# Altium schematic sheet MKV58(1.SchDoc
size A3; Organization: Altium Limited; Address1: L3, 12a Rodborough Rd; Address2: Frenchs Forest; Address3: NSW; Address4: Australia 2086
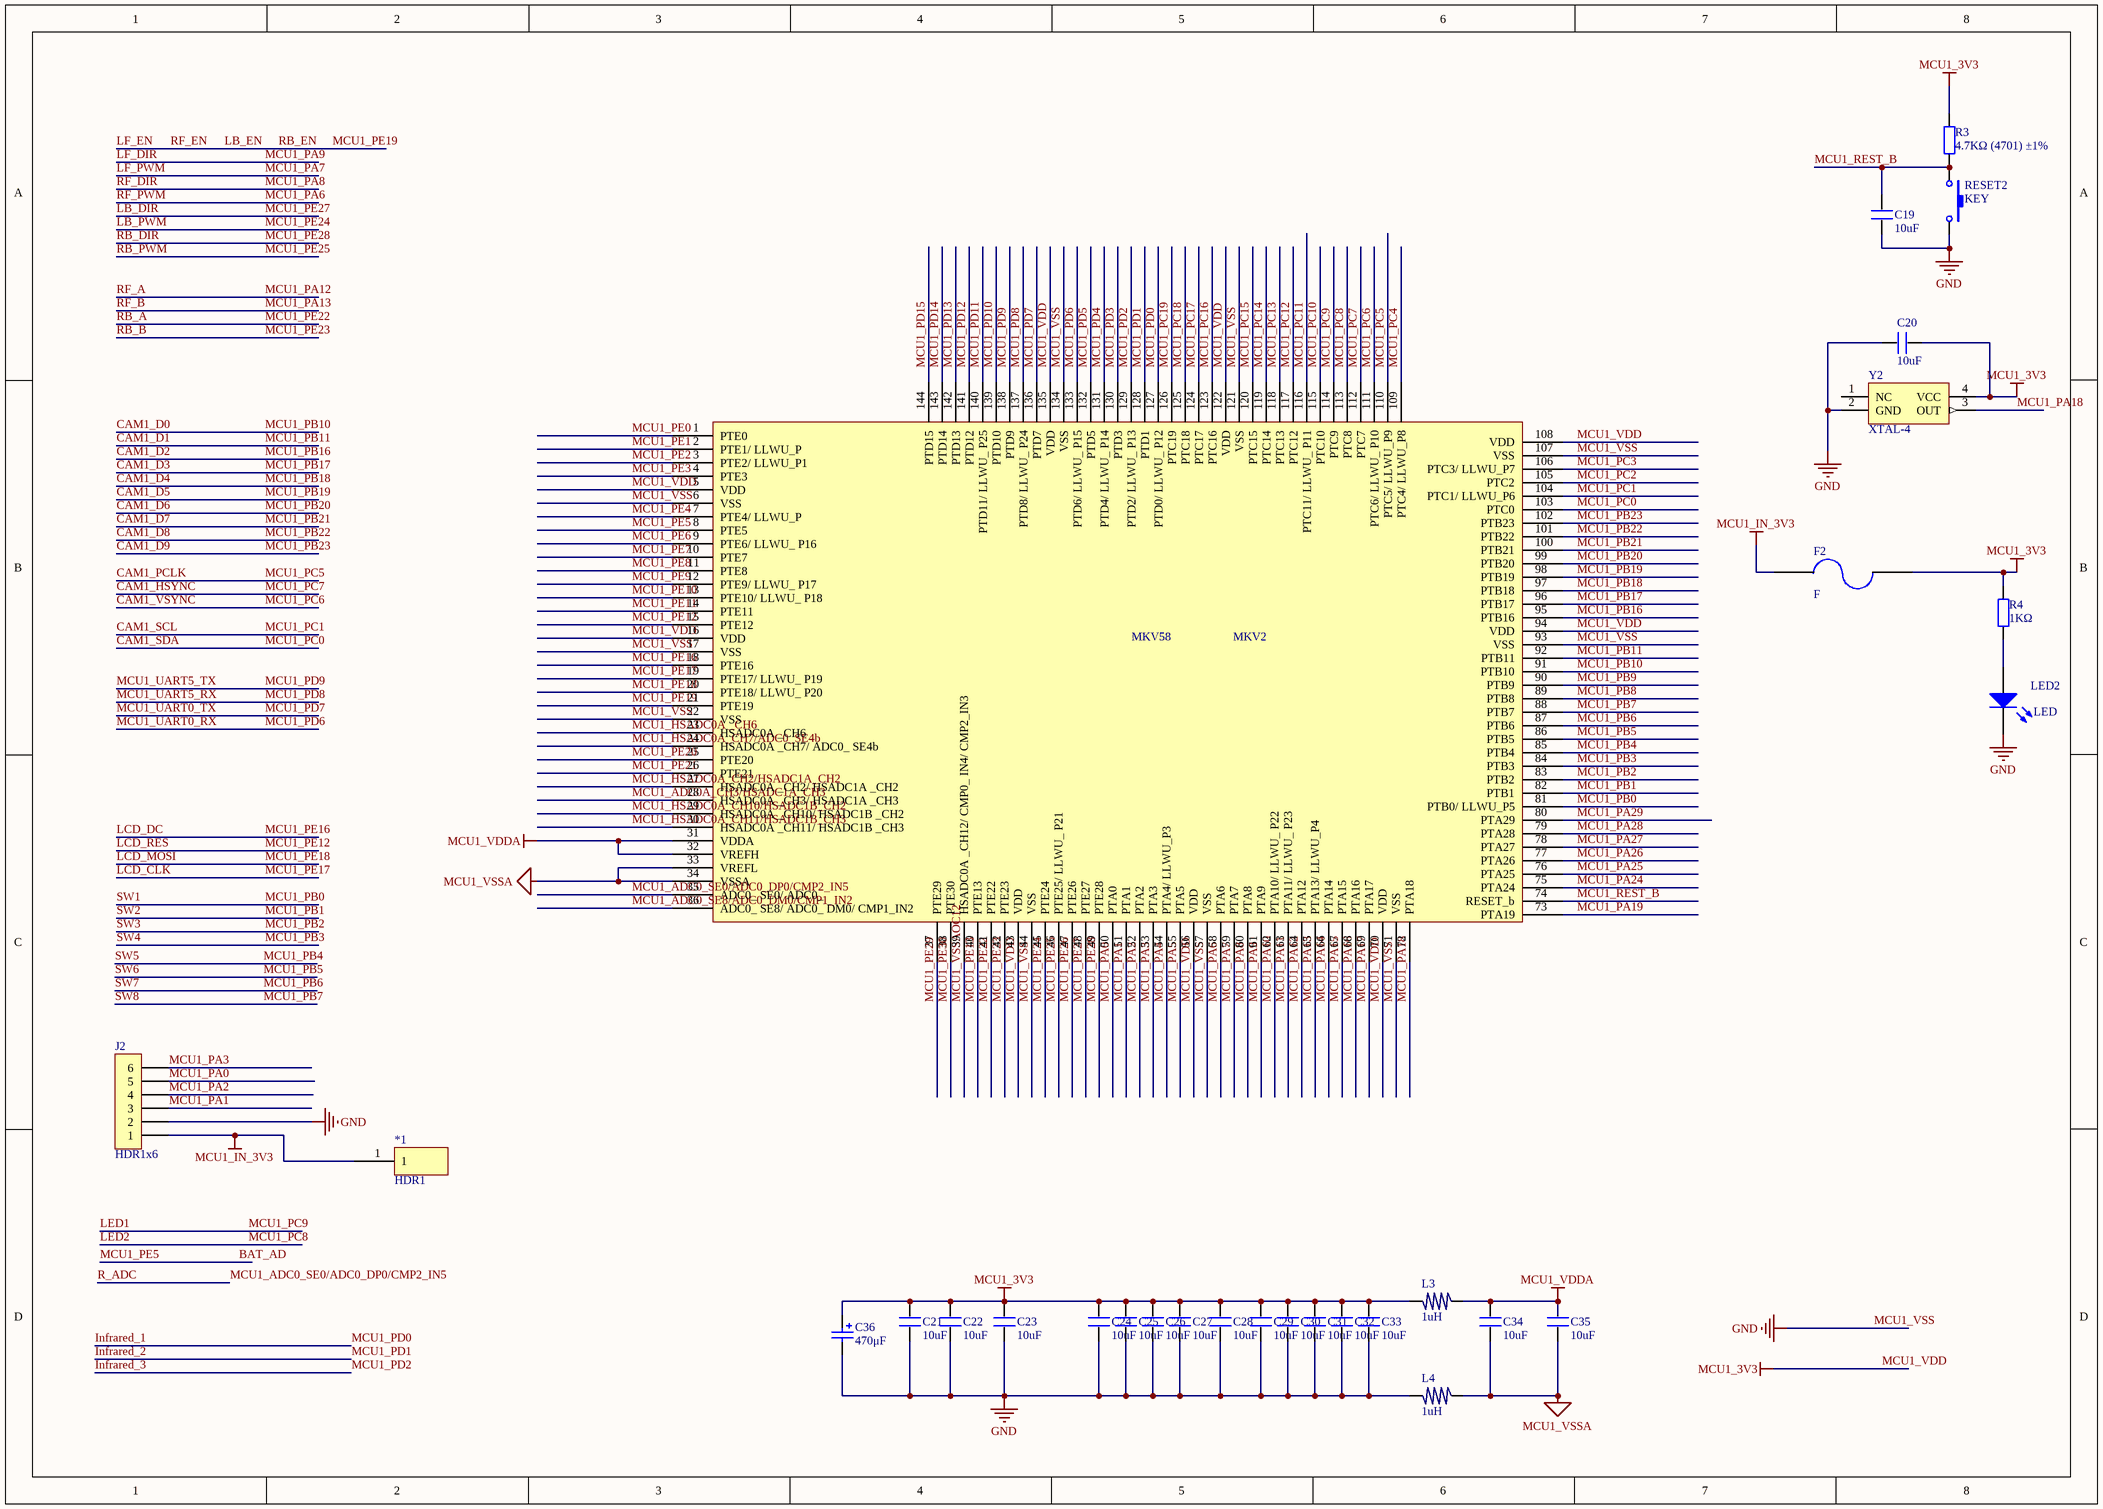
[diagram p0: MKV58(1.SchDoc]

## Parts
*1  HDR1  [HDR1]
C19  10uF  [0805_C]
C20  10uF  [0805_C]
C21  10uF  [0805_C]
C22  10uF  [0805_C]
C23  10uF  [0805_C]
C24  10uF  [0805_C]
C25  10uF  [0805_C]
C26  10uF  [0805_C]
C27  10uF  [0805_C]
C28  10uF  [0805_C]
C29  10uF  [0805_C]
C30  10uF  [0805_C]
C31  10uF  [0805_C]
C32  10uF  [0805_C]
C33  10uF  [0805_C]
C34  10uF  [0805_C]
C35  10uF  [0805_C]
C36  470μF  [CASE C6032]
F2  F  [0805_R]
J2  HDR1x6  [PIN-6-2.54-1.0]
L3  1uH  [0805]
L4  1uH  [0805]
LED2  LED  [LED(0805)]
MKV2  MKV58  [LQFP144]
R3  4.7KΩ (4701) ±1%  [0805_R]
R4  1KΩ  [0805_R]
RESET2  KEY  [Key_PB]
Y2  XTAL-4  [XTAL-5.0X3.2]

## Nets
MCU1_IN_3V3: *1.1 F2.1 J2.1
MCU1_VDD: C20.2 C21.2 C22.2 C23.2 C24.2 C25.2 C26.2 C27.2 C28.2 C29.2 C30.2 C31.2 C32.2 C33.2 C36.1 F2.2 L3.2 MKV2.5(VDD) MKV2.16(VDD) MKV2.43(VDD) MKV2.56(VDD) MKV2.70(VDD) MKV2.94(VDD) MKV2.108(VDD) MKV2.122(VDD) MKV2.135(VDD) R3.2 R4.2 Y2.4(VCC)  [also labelled MCU1_3V3]
MCU1_VDDA: C34.2 C35.2 L3.1 MKV2.31(VDDA) MKV2.32(VREFH)
MCU1_VSS: C19.1 C20.1 C21.1 C22.1 C23.1 C24.1 C25.1 C26.1 C27.1 C28.1 C29.1 C30.1 C31.1 C32.1 C33.1 C36.2 J2.2 L4.2 LED2.2(K) MKV2.6(VSS) MKV2.17(VSS) MKV2.22(VSS) MKV2.44(VSS) MKV2.57(VSS) MKV2.71(VSS) MKV2.93(VSS) MKV2.107(VSS) MKV2.121(VSS) MKV2.134(VSS) RESET2.2 Y2.2(GND)  [also labelled GND]
MCU1_VSSA: C34.1 C35.1 L4.1 MKV2.33(VREFL) MKV2.34(VSSA)
BAT_AD: MKV2.8(PTE5)  [also labelled MCU1_PE5]
CAM1_D0: MKV2.91(PTB10)  [also labelled MCU1_PB10]
CAM1_D1: MKV2.92(PTB11)  [also labelled MCU1_PB11]
CAM1_D2: MKV2.95(PTB16)  [also labelled MCU1_PB16]
CAM1_D3: MKV2.96(PTB17)  [also labelled MCU1_PB17]
CAM1_D4: MKV2.97(PTB18)  [also labelled MCU1_PB18]
CAM1_D5: MKV2.98(PTB19)  [also labelled MCU1_PB19]
CAM1_D6: MKV2.99(PTB20)  [also labelled MCU1_PB20]
CAM1_D7: MKV2.100(PTB21)  [also labelled MCU1_PB21]
CAM1_D8: MKV2.101(PTB22)  [also labelled MCU1_PB22]
CAM1_D9: MKV2.102(PTB23)  [also labelled MCU1_PB23]
CAM1_HSYNC: MKV2.112(PTC7)  [also labelled MCU1_PC7]
CAM1_PCLK: MKV2.110(PTC5/_LLWU_P9)  [also labelled MCU1_PC5]
CAM1_SCL: MKV2.104(PTC1/_LLWU_P6)  [also labelled MCU1_PC1]
CAM1_SDA: MKV2.103(PTC0)  [also labelled MCU1_PC0]
CAM1_VSYNC: MKV2.111(PTC6/_LLWU__P10)  [also labelled MCU1_PC6]
Infrared_1: MKV2.127(PTD0/_LLWU__P12)  [also labelled MCU1_PD0]
Infrared_2: MKV2.128(PTD1)  [also labelled MCU1_PD1]
Infrared_3: MKV2.129(PTD2/_LLWU__P13)  [also labelled MCU1_PD2]
LB_DIR: MKV2.48(PTE27)  [also labelled MCU1_PE27]
LB_EN: MKV2.21(PTE19)  [also labelled LF_EN, MCU1_PE19, RB_EN, RF_EN]
LB_PWM: MKV2.45(PTE24)  [also labelled MCU1_PE24]
LCD_CLK: MKV2.19(PTE17/_LLWU__P19)  [also labelled MCU1_PE17]
LCD_DC: MKV2.18(PTE16)  [also labelled MCU1_PE16]
LCD_MOSI: MKV2.20(PTE18/_LLWU__P20)  [also labelled MCU1_PE18]
LCD_RES: MKV2.15(PTE12)  [also labelled MCU1_PE12]
LED1: MKV2.114(PTC9)  [also labelled MCU1_PC9]
LED2: MKV2.113(PTC8)  [also labelled MCU1_PC8]
LF_DIR: MKV2.61(PTA9)  [also labelled MCU1_PA9]
LF_PWM: MKV2.59(PTA7)  [also labelled MCU1_PA7]
MCU1_ADC0_SE0/ADC0_DP0/CMP2_IN5: MKV2.35(ADC0__SE0/_ADC0_)  [also labelled R_ADC]
MCU1_ADC0_SE8/ADC0_DM0/CMP1_IN2: MKV2.36(ADC0__SE8/_ADC0__DM0/_CMP1_IN2)
MCU1_ADC0A_CH3/HSADC1A_CH3: MKV2.28(HSADC0A__CH3/_HSADC1A__CH3)
MCU1_HSADC0A _CH6: MKV2.23(HSADC0A__CH6)
MCU1_HSADC0A_CH2/HSADC1A_CH2: MKV2.27(HSADC0A__CH2/_HSADC1A__CH2)
MCU1_HSADC0A_CH7/ADC0_SE4b: MKV2.24(HSADC0A__CH7/_ADC0__SE4b)
MCU1_HSADC0A_CH10/HSADC1B_CH2: MKV2.29(HSADC0A__CH10/_HSADC1B__CH2)
MCU1_HSADC0A_CH11/HSADC1B_CH3: MKV2.30(HSADC0A__CH11/_HSADC1B__CH3)
MCU1_PA0: J2.5 MKV2.50(PTA0)
MCU1_PA1: J2.3 MKV2.51(PTA1)
MCU1_PA2: J2.4 MKV2.52(PTA2)
MCU1_PA3: J2.6 MKV2.53(PTA3)
MCU1_PA4: MKV2.54(PTA4/_LLWU_P3)
MCU1_PA5: MKV2.55(PTA5)
MCU1_PA6: MKV2.58(PTA6)  [also labelled RF_PWM]
MCU1_PA8: MKV2.60(PTA8)  [also labelled RF_DIR]
MCU1_PA10: MKV2.62(PTA10/_LLWU__P22)
MCU1_PA11: MKV2.63(PTA11/_LLWU__P23)
MCU1_PA12: MKV2.64(PTA12)  [also labelled RF_A]
MCU1_PA13: MKV2.65(PTA13/_LLWU_P4)  [also labelled RF_B]
MCU1_PA14: MKV2.66(PTA14)
MCU1_PA15: MKV2.67(PTA15)
MCU1_PA16: MKV2.68(PTA16)
MCU1_PA17: MKV2.69(PTA17)
MCU1_PA18: MKV2.72(PTA18) Y2.3(OUT)
MCU1_PA19: MKV2.73(PTA19)
MCU1_PA24: MKV2.75(PTA24)
MCU1_PA25: MKV2.76(PTA25)
MCU1_PA26: MKV2.77(PTA26)
MCU1_PA27: MKV2.78(PTA27)
MCU1_PA28: MKV2.79(PTA28)
MCU1_PA29: MKV2.80(PTA29)
MCU1_PB0: MKV2.81(PTB0/_LLWU_P5)  [also labelled SW1]
MCU1_PB1: MKV2.82(PTB1)  [also labelled SW2]
MCU1_PB2: MKV2.83(PTB2)  [also labelled SW3]
MCU1_PB3: MKV2.84(PTB3)  [also labelled SW4]
MCU1_PB4: MKV2.85(PTB4)  [also labelled SW5]
MCU1_PB5: MKV2.86(PTB5)  [also labelled SW6]
MCU1_PB6: MKV2.87(PTB6)  [also labelled SW7]
MCU1_PB7: MKV2.88(PTB7)  [also labelled SW8]
MCU1_PB8: MKV2.89(PTB8)
MCU1_PB9: MKV2.90(PTB9)
MCU1_PC2: MKV2.105(PTC2)
MCU1_PC3: MKV2.106(PTC3/_LLWU_P7)
MCU1_PC4: MKV2.109(PTC4/_LLWU_P8)
MCU1_PC10: MKV2.115(PTC10)
MCU1_PC11: MKV2.116(PTC11/_LLWU__P11)
MCU1_PC12: MKV2.117(PTC12)
MCU1_PC13: MKV2.118(PTC13)
MCU1_PC14: MKV2.119(PTC14)
MCU1_PC15: MKV2.120(PTC15)
MCU1_PC16: MKV2.123(PTC16)
MCU1_PC17: MKV2.124(PTC17)
MCU1_PC18: MKV2.125(PTC18)
MCU1_PC19: MKV2.126(PTC19)
MCU1_PD3: MKV2.130(PTD3)
MCU1_PD4: MKV2.131(PTD4/_LLWU__P14)
MCU1_PD5: MKV2.132(PTD5)
MCU1_PD6: MKV2.133(PTD6/_LLWU__P15)  [also labelled MCU1_UART0_RX]
MCU1_PD7: MKV2.136(PTD7)  [also labelled MCU1_UART0_TX]
MCU1_PD8: MKV2.137(PTD8/_LLWU__P24)  [also labelled MCU1_UART5_RX]
MCU1_PD9: MKV2.138(PTD9)  [also labelled MCU1_UART5_TX]
MCU1_PD10: MKV2.139(PTD10)
MCU1_PD11: MKV2.140(PTD11/_LLWU__P25)
MCU1_PD12: MKV2.141(PTD12)
MCU1_PD13: MKV2.142(PTD13)
MCU1_PD14: MKV2.143(PTD14)
MCU1_PD15: MKV2.144(PTD15)
MCU1_PE0: MKV2.1(PTE0)
MCU1_PE1: MKV2.2(PTE1/_LLWU_P)
MCU1_PE2: MKV2.3(PTE2/_LLWU_P1)
MCU1_PE3: MKV2.4(PTE3)
MCU1_PE4: MKV2.7(PTE4/_LLWU_P)
MCU1_PE6: MKV2.9(PTE6/_LLWU__P16)
MCU1_PE7: MKV2.10(PTE7)
MCU1_PE8: MKV2.11(PTE8)
MCU1_PE9: MKV2.12(PTE9/_LLWU__P17)
MCU1_PE10: MKV2.13(PTE10/_LLWU__P18)
MCU1_PE11: MKV2.14(PTE11)
MCU1_PE13: MKV2.40(PTE13)
MCU1_PE20: MKV2.25(PTE20)
MCU1_PE21: MKV2.26(PTE21)
MCU1_PE22: MKV2.41(PTE22)  [also labelled RB_A]
MCU1_PE23: MKV2.42(PTE23)  [also labelled RB_B]
MCU1_PE25: MKV2.46(PTE25/_LLWU__P21)  [also labelled RB_PWM]
MCU1_PE26: MKV2.47(PTE26)
MCU1_PE28: MKV2.49(PTE28)  [also labelled RB_DIR]
MCU1_PE29: MKV2.37(PTE29)
MCU1_PE30: MKV2.38(PTE30)
MCU1_REST_B: C19.2 MKV2.74(RESET_b) R3.1 RESET2.1
MCU1_VSSAOC12: MKV2.39(HSADC0A__CH12/_CMP0__IN4/_CMP2_IN3)
NetLED2_1: LED2.1(A) R4.1

Not connected (* = marked no-connect by the designer): Y2 1(NC)

## Notes on the sheet
- Title
- Size:
- Date:
- File:
- A2
- Number:
- Time:
- Revision:
- Sheet
- of

## Library data of the parts
C19-C35 = C
C36 = Cap(Ta)
J2 = HDR1x6: Connector
L3 L4 = L
LED2 = LED(0805)
R3 = 0805 4.7KΩ (4701) 1%: 贴片电阻; ComponentLink1Description: 供应商链接; ComponentLink1URL: http://www.szlcsc.com/product/details_18361.html; Package: 0805; Supplier: LC; SuppliersPartNumber: C17673
R4 = 0805 1.5KΩ (1501) 1%: 贴片电阻; ComponentLink1Description: 供应商链接; ComponentLink1URL: http://www.szlcsc.com/product/details_4717.html; Package: 0805; Supplier: LC; SuppliersPartNumber: C4310
RESET2 = Key_1
Y2 = XTAL-4: Oscillator